# Altium schematic sheet PMOD.SchDoc: PMOD
size Letter; ApprovedBy: Kevin; Author: Jessica; Organization: Cegep Limoilou; Address1: 1300, 8e Avenue; Address2: Québec, QC; Address3: Canada; Address4: G1J 5L5; Revision: A; SheetNumber: 3; SheetTotal: 4
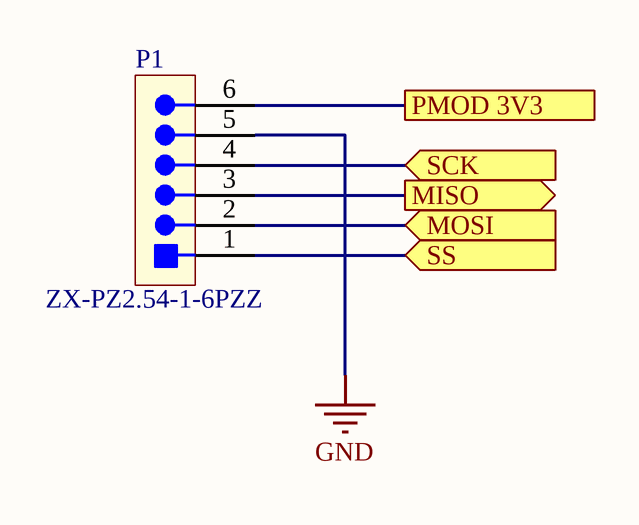
[diagram p0: PMOD.SchDoc]

## Parts
P1  ZX-PZ2.54-1-6PZZ  [CONN_HDR_01X06_100MIL]  (no BOM)

## Ports
MISO (out), MOSI (in), PMOD 3V3, SCK (in), SS (in)

## Nets
GND: P1.5
MISO: P1.3 ; port MISO
MOSI: P1.2 ; port MOSI
PMOD 3V3: P1.6 ; port PMOD 3V3
SCK: P1.4 ; port SCK
SS: P1.1 ; port SS

## Notes on the sheet
- Titre :
- Conception :
- Date :
- Approbation :
- Heure :
- Révision :
- Feuille
- de
- Fichier :

## Library data of the parts
P1 = CONN-100MIL-HDR-01X06: Conn. Header 6pos 100mils; Manufacturer 1: Megastar; Mounting Technology: TH; Manufacturer Part Number 1: ZX-PZ2.54-1-6PZZ; Manufacturer 2: Würth Elektronik; Manufacturer Part Number 2: 61300611121; Supplier 1: LCSC; Supplier 2: Digikey; Supplier Part Number 2: 732-5319-ND; Supplier Part Number 1: C7501264